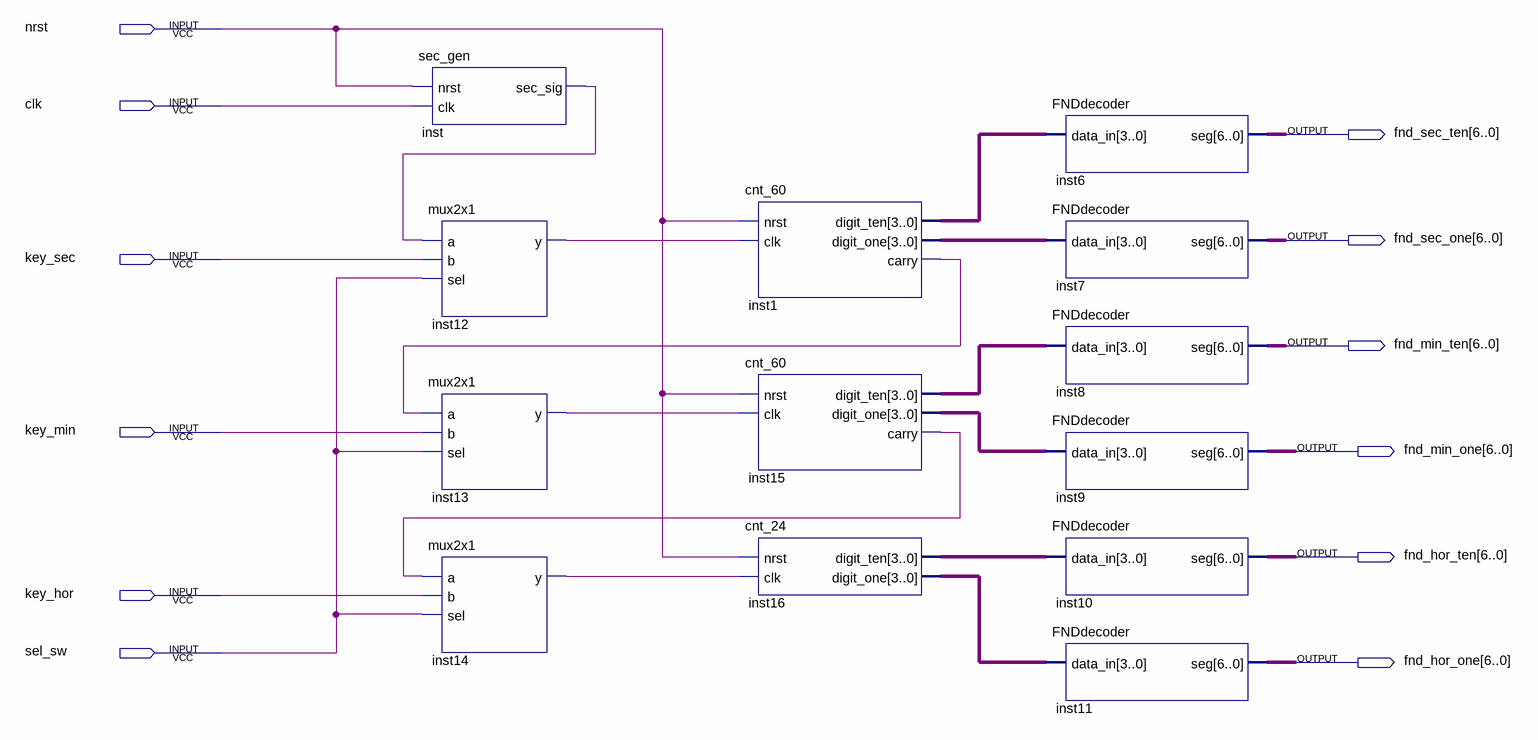
[diagram p0: schematic sheet]
// Quartus schematic DETtime.bdf as structural Verilog: 13 symbols, 12 pins
module DETtime (
  input  nrst,
  input  clk,
  input  key_sec,
  input  key_min,
  input  key_hor,
  input  sel_sw,
  output [6:0] fnd_sec_ten,
  output [6:0] fnd_sec_one,
  output [6:0] fnd_min_ten,
  output [6:0] fnd_min_one,
  output [6:0] fnd_hor_ten,
  output [6:0] fnd_hor_one
);

  wire inst1_carry, inst12_y, inst13_y, inst14_y, inst15_carry, inst_sec_sig;
  wire [3:0] inst1_digit_one, inst1_digit_ten, inst15_digit_one, inst15_digit_ten, inst16_digit_one,
       inst16_digit_ten;

  sec_gen inst (.nrst(nrst), .clk(clk), .sec_sig(inst_sec_sig));
  mux2x1 inst12 (.a(inst_sec_sig), .b(key_sec), .sel(sel_sw), .y(inst12_y));
  mux2x1 inst13 (.a(inst1_carry), .b(key_min), .sel(sel_sw), .y(inst13_y));
  mux2x1 inst14 (.a(inst15_carry), .b(key_hor), .sel(sel_sw), .y(inst14_y));
  cnt_60 inst1 (
    .nrst(nrst), .clk(inst12_y), .digit_ten(inst1_digit_ten), .digit_one(inst1_digit_one), .carry(inst1_carry));
  cnt_60 inst15 (
    .nrst(nrst), .clk(inst13_y), .digit_ten(inst15_digit_ten), .digit_one(inst15_digit_one),
    .carry(inst15_carry));
  cnt_24 inst16 (.nrst(nrst), .clk(inst14_y), .digit_ten(inst16_digit_ten), .digit_one(inst16_digit_one));
  FNDdecoder inst6 (.data_in(inst1_digit_ten), .seg(fnd_sec_ten));
  FNDdecoder inst7 (.data_in(inst1_digit_one), .seg(fnd_sec_one));
  FNDdecoder inst8 (.data_in(inst15_digit_ten), .seg(fnd_min_ten));
  FNDdecoder inst9 (.data_in(inst15_digit_one), .seg(fnd_min_one));
  FNDdecoder inst10 (.data_in(inst16_digit_ten), .seg(fnd_hor_ten));
  FNDdecoder inst11 (.data_in(inst16_digit_one), .seg(fnd_hor_one));
endmodule
